# Altium schematic sheet layout.SchDoc
size A4
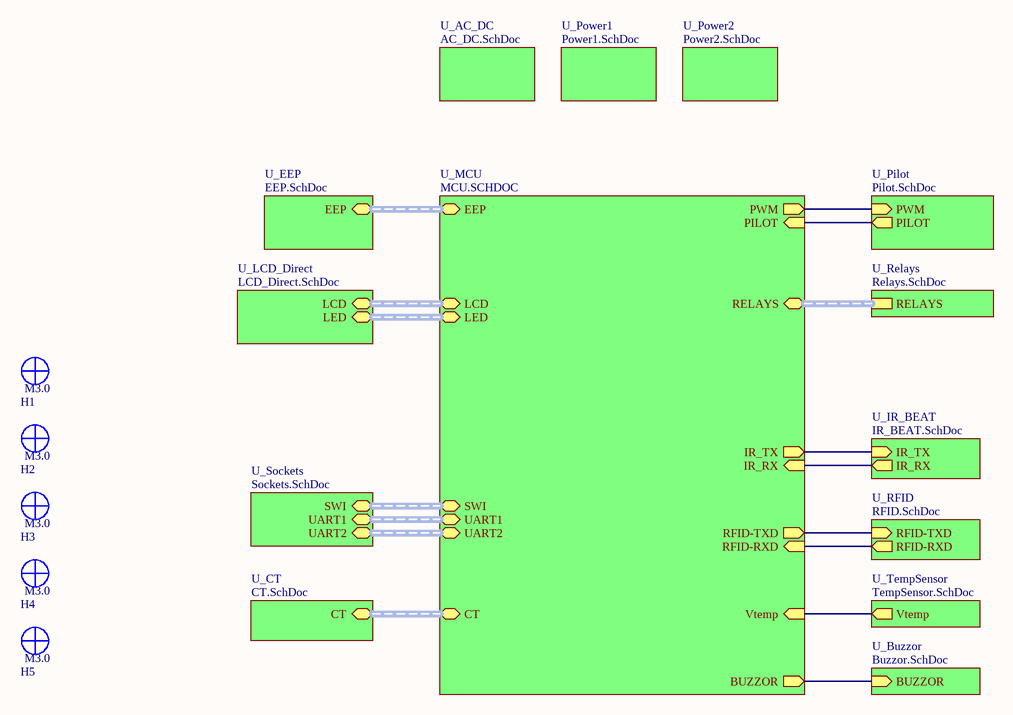
[diagram p0: layout.SchDoc]

## Parts
H1  M3.0  [SCREW_HOLE_3.5]  (value not drawn)  (no BOM)
H2  M3.0  [SCREW_HOLE_3.5]  (value not drawn)  (no BOM)
H3  M3.0  [SCREW_HOLE_3.5]  (value not drawn)  (no BOM)
H4  M3.0  [SCREW_HOLE_3.5]  (value not drawn)  (no BOM)
H5  M3.0  [SCREW_HOLE_3.5]  (value not drawn)  (no BOM)

## Sub-sheets
U_AC_DC = AC_DC.SchDoc: no entries
U_Buzzor = Buzzor.SchDoc: BUZZOR (in)
U_CT = CT.SchDoc: CT (harness CT)
U_EEP = EEP.SchDoc: EEP (harness EEP)
U_IR_BEAT = IR_BEAT.SchDoc: IR_RX (out), IR_TX (in)
U_LCD_Direct = LCD_Direct.SchDoc: LCD (harness LCD), LED (harness LED)
U_MCU = MCU.SCHDOC: PWM (out), PILOT (in), Vtemp (in), IR_TX (out), RFID-TXD (out), IR_RX (in), RFID-RXD (in), BUZZOR (out), SWI (harness SWI), LCD (harness LCD), LED (harness LED), EEP (harness EEP), RELAYS (harness RELAYS), CT (harness CT), UART2 (harness UART2), UART1 (harness UART1)
U_Pilot = Pilot.SchDoc: PWM (in), PILOT (out)
U_Power1 = Power1.SchDoc: no entries
U_Power2 = Power2.SchDoc: no entries
U_Relays = Relays.SchDoc: RELAYS (harness RELAYS)
U_RFID = RFID.SchDoc: RFID-TXD (in), RFID-RXD (out)
U_Sockets = Sockets.SchDoc: SWI (harness SWI), UART2 (harness UART2), UART1 (harness UART1)
U_TempSensor = TempSensor.SchDoc: Vtemp (out)

## Nets
(unnamed): sheet U_MCU/PWM, sheet U_Pilot/PWM
(unnamed): sheet U_MCU/PILOT, sheet U_Pilot/PILOT
(unnamed): sheet U_MCU/Vtemp, sheet U_TempSensor/Vtemp
(unnamed): sheet U_MCU/IR_TX, sheet U_IR_BEAT/IR_TX
(unnamed): sheet U_MCU/RFID-TXD, sheet U_RFID/RFID-TXD
(unnamed): sheet U_MCU/IR_RX, sheet U_IR_BEAT/IR_RX
(unnamed): sheet U_MCU/RFID-RXD, sheet U_RFID/RFID-RXD
(unnamed): sheet U_MCU/BUZZOR, sheet U_Buzzor/BUZZOR

## Buses and harness runs
harness sheet U_CT/CT = sheet U_MCU/CT
harness sheet U_EEP/EEP = sheet U_MCU/EEP
harness sheet U_LCD_Direct/LCD = sheet U_MCU/LCD
harness sheet U_LCD_Direct/LED = sheet U_MCU/LED
harness sheet U_MCU/RELAYS = sheet U_Relays/RELAYS
harness sheet U_MCU/SWI = sheet U_Sockets/SWI
harness sheet U_MCU/UART1 = sheet U_Sockets/UART1
harness sheet U_MCU/UART2 = sheet U_Sockets/UART2

## Library data of the parts
H1-H5 = SCRE_HOLE_3.2: Screw hole for M3.0